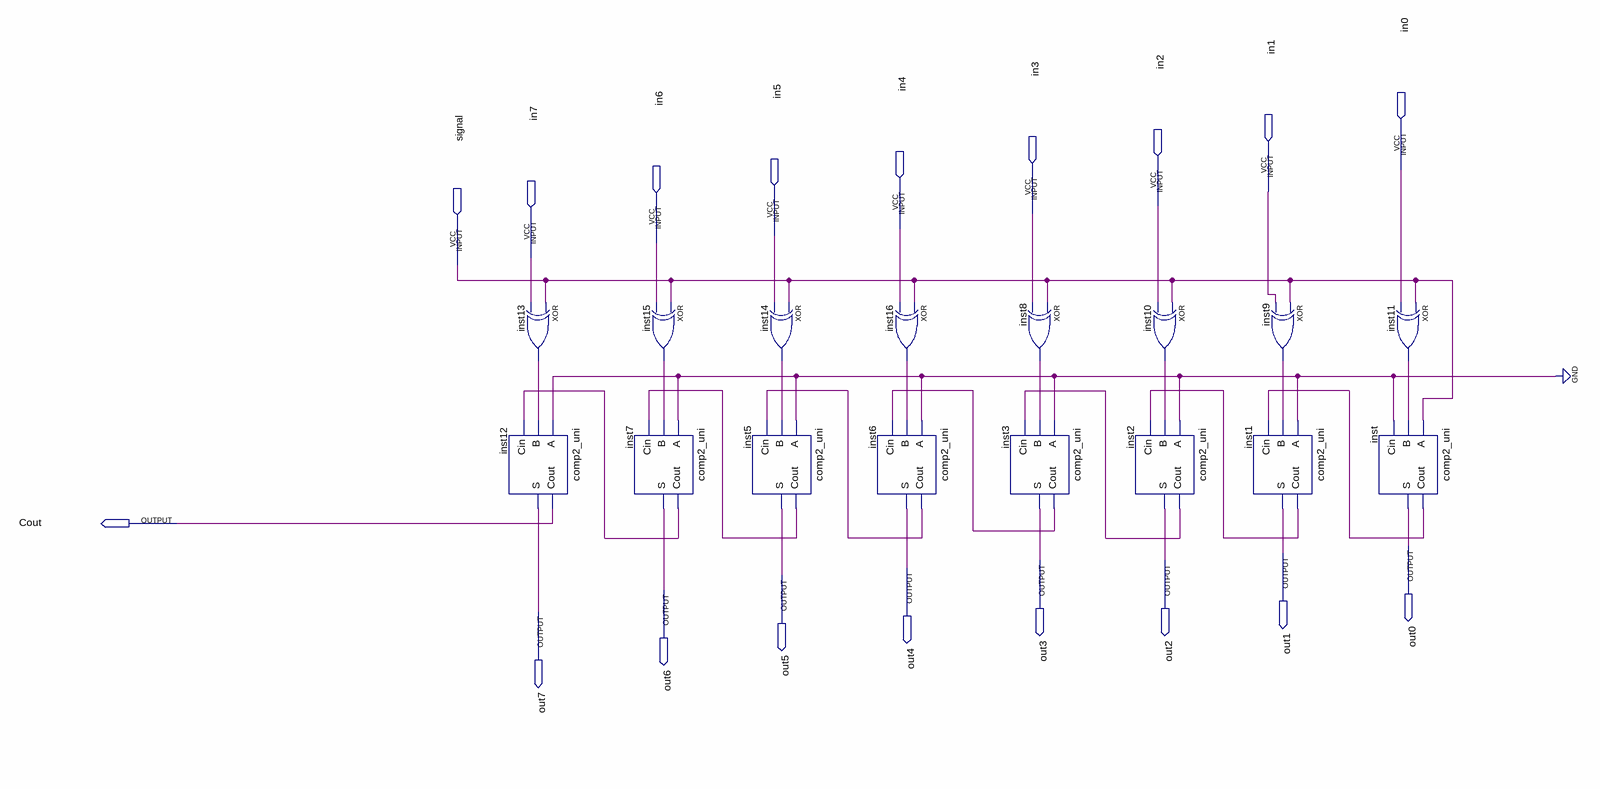
[diagram p0: schematic sheet]
// Quartus schematic comp2_9bits.bdf as structural Verilog: 16 symbols, 18 pins
module comp2_9bits (
  input  in0,
  input  in1,
  input  in2,
  input  in3,
  input  in4,
  input  in5,
  input  in6,
  input  in7,
  input  signal,
  output Cout,
  output out0,
  output out1,
  output out3,
  output out2,
  output out4,
  output out5,
  output out6,
  output out7
);

  wire inst1_cout, inst2_cout, inst3_cout, inst5_cout, inst6_cout, inst7_cout, inst8_out, inst9_out,
       inst10_out, inst11_out, inst13_out, inst14_out, inst15_out, inst16_out, inst_cout;

  xor inst13 (inst13_out, signal, in7);
  comp2_uni inst12 (.A(1'b0), .B(inst13_out), .Cin(inst7_cout), .Cout(Cout), .S(out7));
  xor inst15 (inst15_out, signal, in6);
  comp2_uni inst7 (.A(1'b0), .B(inst15_out), .Cin(inst5_cout), .Cout(inst7_cout), .S(out6));
  xor inst14 (inst14_out, signal, in5);
  comp2_uni inst5 (.A(1'b0), .B(inst14_out), .Cin(inst6_cout), .Cout(inst5_cout), .S(out5));
  xor inst16 (inst16_out, signal, in4);
  comp2_uni inst6 (.A(1'b0), .B(inst16_out), .Cin(inst3_cout), .Cout(inst6_cout), .S(out4));
  comp2_uni inst3 (.A(1'b0), .B(inst8_out), .Cin(inst2_cout), .Cout(inst3_cout), .S(out3));
  xor inst8 (inst8_out, signal, in3);
  comp2_uni inst2 (.A(1'b0), .B(inst10_out), .Cin(inst1_cout), .Cout(inst2_cout), .S(out2));
  xor inst10 (inst10_out, signal, in2);
  comp2_uni inst1 (.A(1'b0), .B(inst9_out), .Cin(inst_cout), .Cout(inst1_cout), .S(out1));
  xor inst9 (inst9_out, signal, in1);
  xor inst11 (inst11_out, signal, in0);
  comp2_uni inst (.A(signal), .B(inst11_out), .Cin(1'b0), .Cout(inst_cout), .S(out0));
endmodule
